# Altium schematic sheet RP2350.SchDoc: RP2350
size B; SheetNumber: 2; SheetTotal: 7
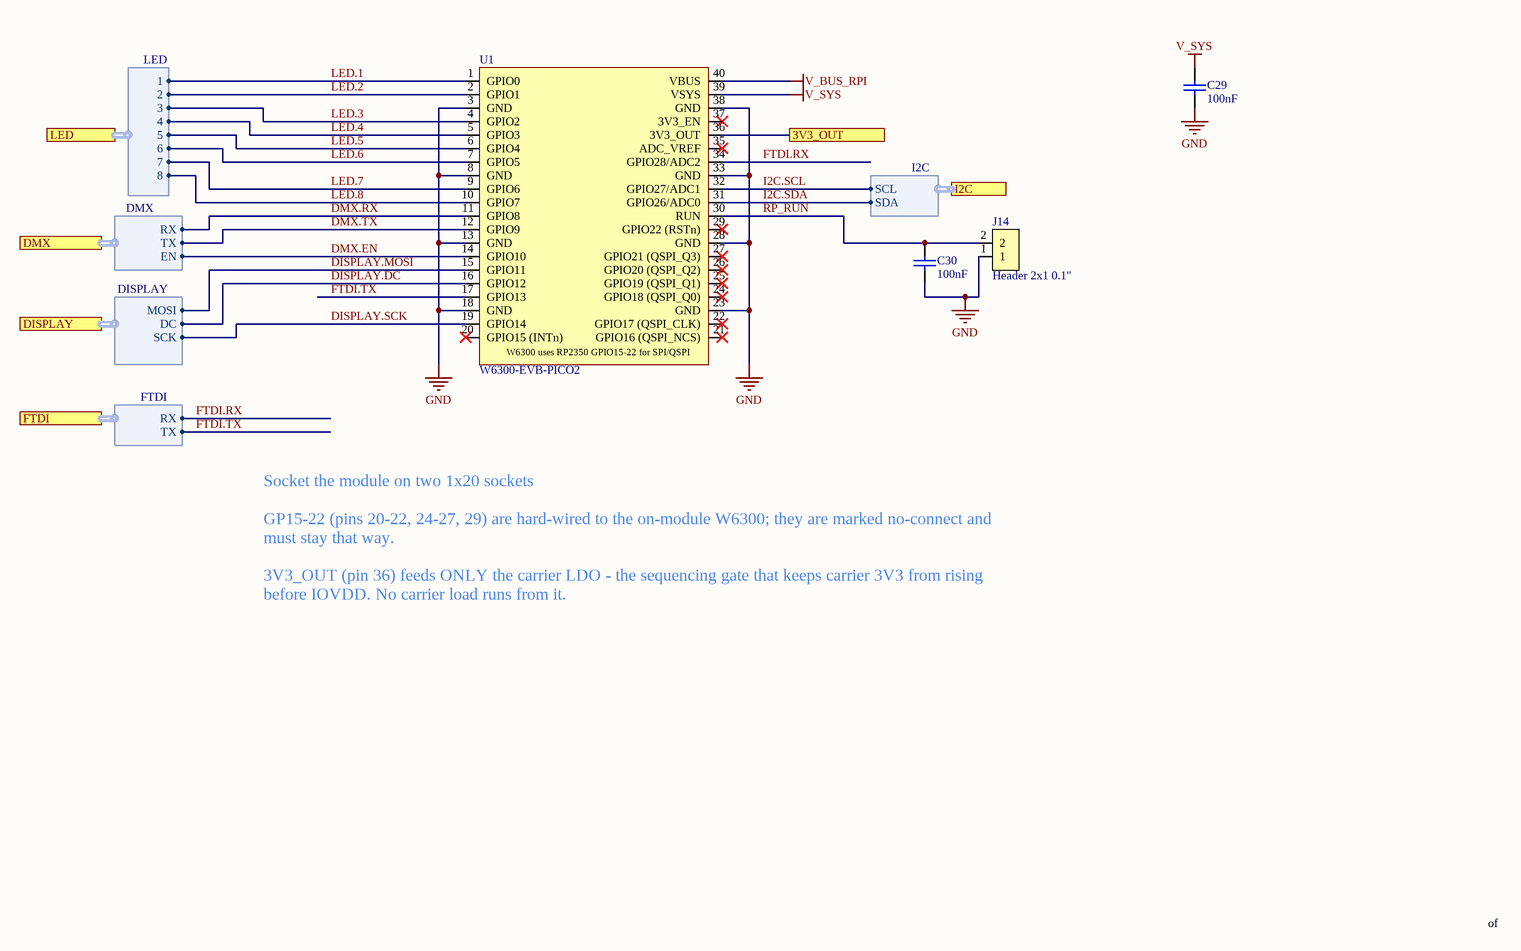
[diagram p0: RP2350.SchDoc]

## Parts
C29  value 100nF  [CAPC1608X10N_0603_MED]  (hidden comment: CC0603KRX7R0BB104)
C30  value 100nF  [CAPC1608X10N_0603_MED]  (hidden comment: CC0603KRX7R0BB104)
J14  Header 2x1 0.1"  [FP-M20-9990245-MFG]
U1  W6300-EVB-PICO2  [W6300-EVB-PICO2_0.4375_standoff]

## Ports
3V3_OUT, DISPLAY (harness DISPLAY), DMX (harness DMX), FTDI (harness FTDI), I2C (harness I2C), LED (harness LED)

## Harnesses
LED: 1, 2, 3, 4, 5, 6, 7, 8
DMX: RX, EN, TX
DISPLAY: MOSI, SCK, DC
FTDI: RX, TX
I2C: SCL, SDA

## Nets
GND: C29.2 C30.2 J14.1 U1.3(GND) U1.8(GND) U1.13(GND) U1.18(GND) U1.23(GND) U1.28(GND) U1.33(GND) U1.38(GND)
V_BUS_RPI: U1.40(VBUS)
V_SYS: C29.1 U1.39(VSYS)
3V3_OUT: U1.36(3V3_OUT) ; port 3V3_OUT
DISPLAY.DC: U1.16(GPIO12) ; port DISPLAY.DC
DISPLAY.MOSI: U1.15(GPIO11) ; port DISPLAY.MOSI
DISPLAY.SCK: U1.19(GPIO14) ; port DISPLAY.SCK
DMX.EN: U1.14(GPIO10) ; port DMX.EN
DMX.RX: U1.11(GPIO8) ; port DMX.RX
DMX.TX: U1.12(GPIO9) ; port DMX.TX
FTDI.RX: U1.34(GPIO28/ADC2) ; port FTDI.RX
FTDI.TX: U1.17(GPIO13) ; port FTDI.TX
I2C.SCL: U1.32(GPIO27/ADC1) ; port I2C.SCL
I2C.SDA: U1.31(GPIO26/ADC0) ; port I2C.SDA
LED.1: U1.1(GPIO0) ; port LED.1
LED.2: U1.2(GPIO1) ; port LED.2
LED.3: U1.4(GPIO2) ; port LED.3
LED.4: U1.5(GPIO3) ; port LED.4
LED.5: U1.6(GPIO4) ; port LED.5
LED.6: U1.7(GPIO5) ; port LED.6
LED.7: U1.9(GPIO6) ; port LED.7
LED.8: U1.10(GPIO7) ; port LED.8
RP_RUN: C30.1 J14.2 U1.30(RUN)

Not connected (* = marked no-connect by the designer): U1 20(GPIO15_(INTn))* 21(GPIO16_(QSPI_NCS))* 22(GPIO17_(QSPI_CLK))* 24(GPIO18_(QSPI_Q0))* 25(GPIO19_(QSPI_Q1))* 26(GPIO20_(QSPI_Q2))* 27(GPIO21_(QSPI_Q3))* 29(GPIO22_(RSTn))* 35(ADC_VREF)* 37(3V3_EN)*

## Notes on the sheet
- Socket the module on two 1x20 sockets
  GP15-22 (pins 20-22, 24-27, 29) are hard-wired to the on-module W6300; they are marked no-connect and must stay that way.
  3V3_OUT (pin 36) feeds ONLY the carrier LDO - the sequencing gate that keeps carrier 3V3 from rising before IOVDD. No carrier load runs from it.
- of
- (in symbol CMP-020-00030-3) W6300 uses RP2350 GPIO15-22 for SPI/QSPI

## Library data of the parts
C29 C30 = CMP-001-00102-4: Ceramic Capacitor, Multilayer, Ceramic, 100V, 10% +Tol, 10% -Tol, X7R, 15% TC, 0.1uF, Surface Mount, 0603; Max Operating Temperature: 125°C; RoHS Compliant: Yes; Case/Package: 0603; Mounting Technology: Surface Mount; Capacitor Type: Ceramic; Pins: 2; Voltage Rating: 100V; Min Operating Temperature: -55°C; JLCPN: C113803
J14 = CMP-002-00082-2: Conn Header Vert 2POS 2.54MM; Connector Type: BOARD CONNECTOR; Min Operating Temperature: -40°C; Mounting Technology: Through Hole; Pins: 2; Max Operating Temperature: 105°C; RoHS Compliant: Yes
U1 = CMP-020-00030-3: Raspberry Pi RP2350 and fully hardwired TCP/IP controller W6300